# Altium schematic sheet Power_Low_V.SchDoc
size A
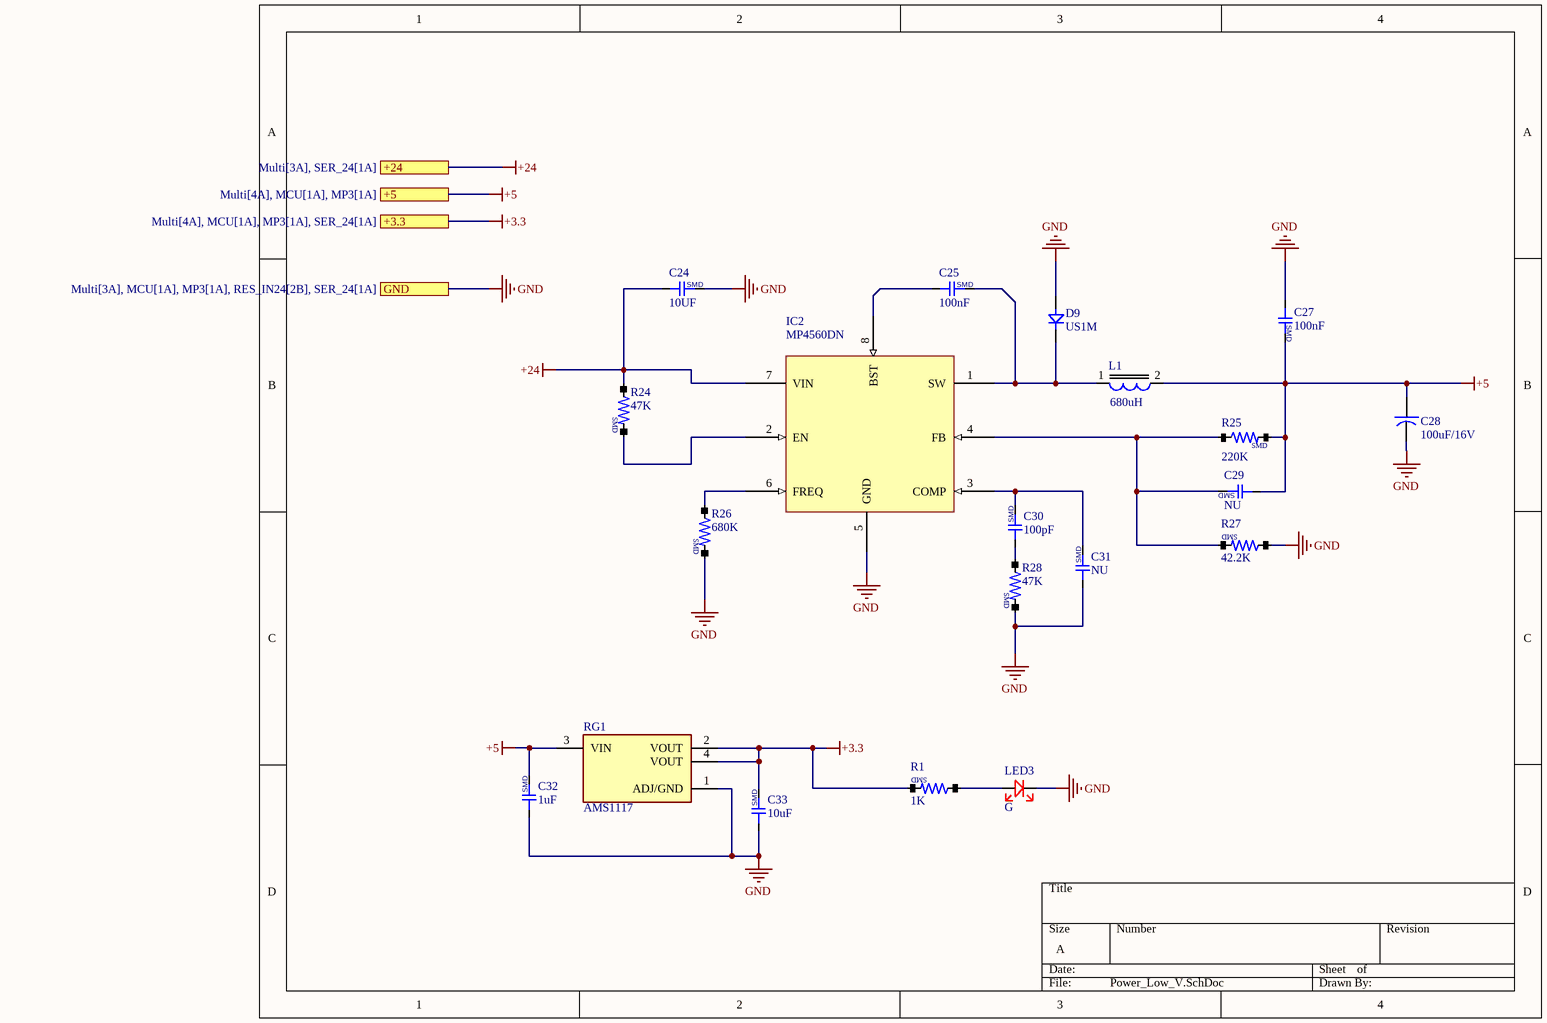
[diagram p0: Power_Low_V.SchDoc]

## Parts
C24  10UF  [CAP-1206]
C25  100nF  [CAP-0603]
C27  100nF  [CAP-0603]
C28  100uF/16V  [CAP-EL-P100mil]
C29  NU  [CAP-0603]
C30  100pF  [CAP-0603]
C31  NU  [CAP-0603]
C32  1uF  [CAP-0805]
C33  10uF  [CAP-0805]
D9  US1M  [DIOD/1N4007/SMD]
IC2  MP4560DN  [SOP8_HIT]
L1  680uH  [NR6028T680]
LED3  G  [LED/0805]
R1  1K  [RES/0603]
R24  47K  [RES/0603]
R25  220K  [RES/0603]
R26  680K  [RES/0805]
R27  42.2K  [RES/0603]
R28  47K  [RES/0603]
RG1  AMS1117  [AMS1117]

## Ports
+3.3 (see Multi[4A], MCU[1A], MP3[1A], SER_24[1A]), +5 (see Multi[4A], MCU[1A], MP3[1A]), +24 (see Multi[3A], SER_24[1A]), GND (see Multi[3A], MCU[1A], MP3[1A], RES_IN24[2B], SER_24[1A])

## Nets
+3.3: C33.2 R1.2 RG1.2(VOUT) RG1.4(VOUT) ; port +3.3
+5: C27.2 C28.+ C29.1 C32.2 L1.2 R25.2 RG1.3(VIN) ; port +5
+24: C24.1 IC2.7(VIN) R24.1 ; port +24
GND: C24.2 C27.1 C28.- C31.1 C32.1 C33.1 D9.A IC2.5(GND) LED3.K R26.2 R27.1 R28.2 RG1.1(ADJ/GND) ; port GND
NetC25_1: C25.1 IC2.8(BST)
NetC25_2: C25.2 D9.K IC2.1(SW) L1.1
NetC29_2: C29.2 IC2.4(FB) R25.1 R27.2
NetC30_1: C30.1 R28.1
NetC30_2: C30.2 C31.2 IC2.3(COMP)
NetIC2_2: IC2.2(EN) R24.2
NetIC2_6: IC2.6(FREQ) R26.1
NetLED3_A: LED3.A R1.1

## Notes on the sheet
- (in symbol cap_smd) SMD
- (in symbol RES/SMD) SMD

## Library data of the parts
C24 C25 C27 C29-C33 = cap_smd
C28 = cap-electrolit
D9 = DIOD/RECTIFIERS
L1 = inductor
LED3 = LED-1COLER
R1 R24-R28 = RES/SMD